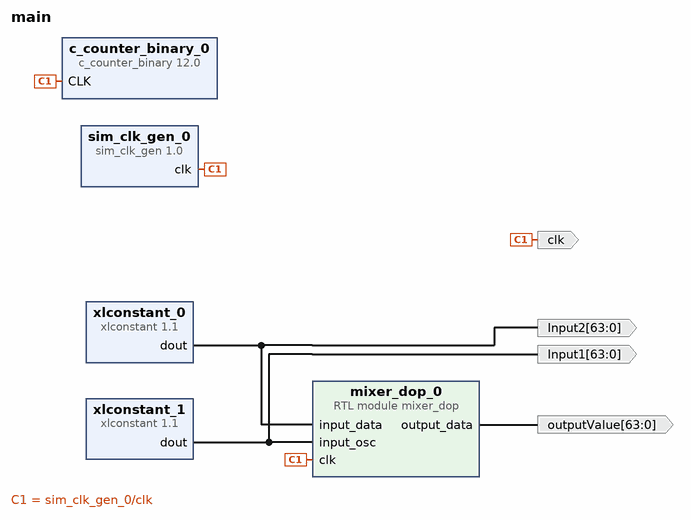
[diagram p0: block diagram of the top level]
# Vivado block design main, xczu48dr-fsvg1517-2-e-es1, Vivado 2020.2
create_bd_design main

create_bd_port -dir O -from 63 -to 0 outputValue
create_bd_port -dir O -from 63 -to 0 Input1
create_bd_port -dir O -from 63 -to 0 Input2
create_bd_port -dir O clk

create_bd_cell -type ip -vlnv xilinx.com:ip:sim_clk_gen:1.0 sim_clk_gen_0
create_bd_cell -type ip -vlnv xilinx.com:ip:c_counter_binary:12.0 c_counter_binary_0
set_property -dict {CONFIG.Output_Width 16} [get_bd_cells c_counter_binary_0]
create_bd_cell -type ip -vlnv xilinx.com:ip:xlconstant:1.1 xlconstant_0
set_property -dict {CONFIG.CONST_VAL 844429224902651 CONFIG.CONST_WIDTH 64} [get_bd_cells xlconstant_0]
create_bd_cell -type ip -vlnv xilinx.com:ip:xlconstant:1.1 xlconstant_1
set_property -dict {CONFIG.CONST_VAL 231721001865919 CONFIG.CONST_WIDTH 64} [get_bd_cells xlconstant_1]
create_bd_cell -type module -reference mixer_dop mixer_dop_0
set_property -dict {CONFIG.degree_of_parallelism 4} [get_bd_cells mixer_dop_0]

# ---- connections ----

connect_bd_net -net blk_mem_gen_0_douta [get_bd_pins xlconstant_0/dout] [get_bd_ports Input2] [get_bd_pins mixer_dop_0/input_data]
connect_bd_net [get_bd_pins sim_clk_gen_0/clk] [get_bd_pins c_counter_binary_0/CLK] [get_bd_ports clk] [get_bd_pins mixer_dop_0/clk]
connect_bd_net -net nco_dop_0_cosValues [get_bd_pins xlconstant_1/dout] [get_bd_ports Input1] [get_bd_pins mixer_dop_0/input_osc]
connect_bd_net [get_bd_pins mixer_dop_0/output_data] [get_bd_ports outputValue]

validate_bd_design
save_bd_design
